# EAGLE design MAX31856_BREAKOUT_x4 (EAGLE 7.2.0)
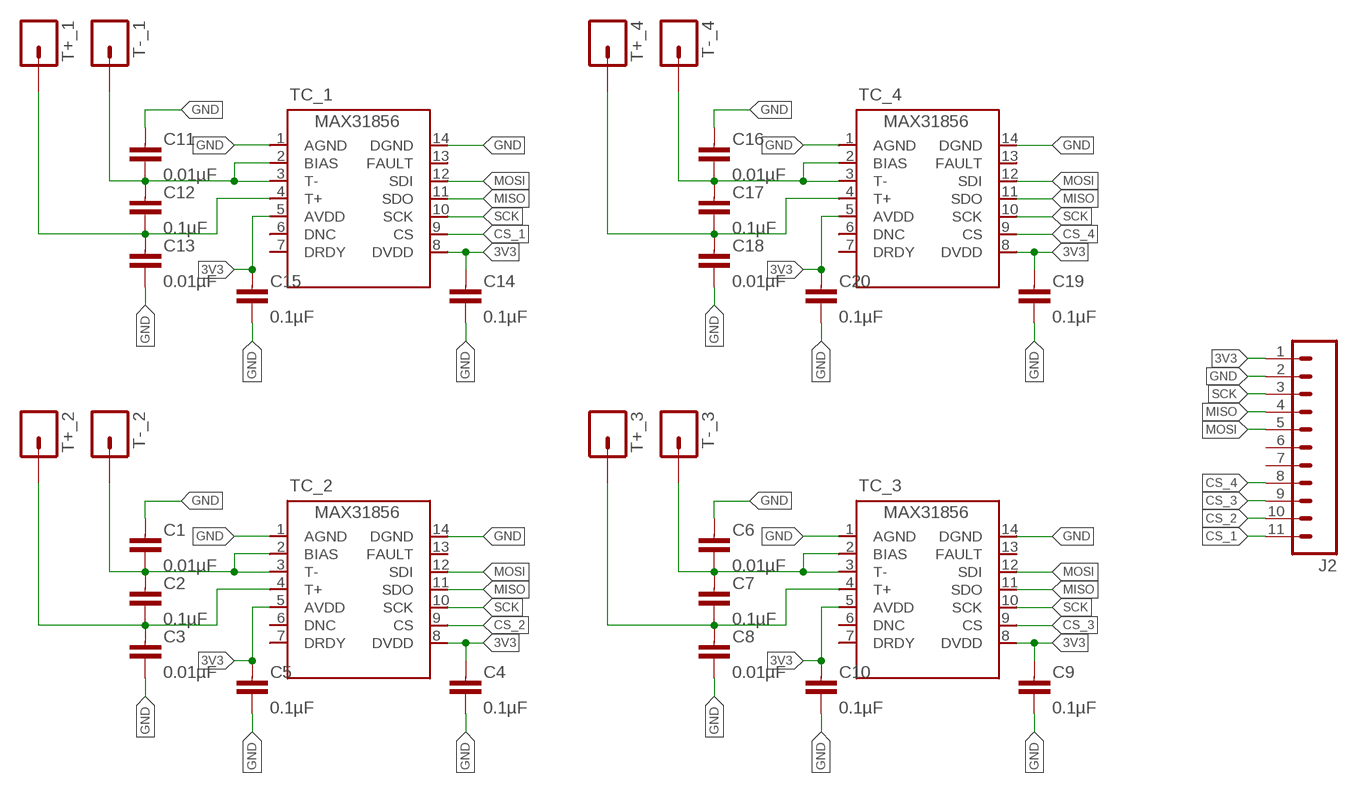
[diagram p0: schematic, sheet 1]

## Parts
C1  0.01µF  CAPACITOR0603-N  [C0603-N]
C2  0.1µF  CAPACITOR0603-N  [C0603-N]
C3  0.01µF  CAPACITOR0603-N  [C0603-N]
C4  0.1µF  CAPACITOR0603-N  [C0603-N]
C5  0.1µF  CAPACITOR0603-N  [C0603-N]
C6  0.01µF  CAPACITOR0603-N  [C0603-N]
C7  0.1µF  CAPACITOR0603-N  [C0603-N]
C8  0.01µF  CAPACITOR0603-N  [C0603-N]
C9  0.1µF  CAPACITOR0603-N  [C0603-N]
C10  0.1µF  CAPACITOR0603-N  [C0603-N]
C11  0.01µF  CAPACITOR0603-N  [C0603-N]
C12  0.1µF  CAPACITOR0603-N  [C0603-N]
C13  0.01µF  CAPACITOR0603-N  [C0603-N]
C14  0.1µF  CAPACITOR0603-N  [C0603-N]
C15  0.1µF  CAPACITOR0603-N  [C0603-N]
C16  0.01µF  CAPACITOR0603-N  [C0603-N]
C17  0.1µF  CAPACITOR0603-N  [C0603-N]
C18  0.01µF  CAPACITOR0603-N  [C0603-N]
C19  0.1µF  CAPACITOR0603-N  [C0603-N]
C20  0.1µF  CAPACITOR0603-N  [C0603-N]
J2  M11PTH  [1X11]
T+_1  M01SMD  [LUXEON-PAD]
T+_2  M01SMD  [LUXEON-PAD]
T+_3  M01SMD  [LUXEON-PAD]
T+_4  M01SMD  [LUXEON-PAD]
T-_1  M01SMD  [LUXEON-PAD]
T-_2  M01SMD  [LUXEON-PAD]
T-_3  M01SMD  [LUXEON-PAD]
T-_4  M01SMD  [LUXEON-PAD]
TC_1  MAX31856MUD+  [TSSOP14]
TC_2  MAX31856MUD+  [TSSOP14]
TC_3  MAX31856MUD+  [TSSOP14]
TC_4  MAX31856MUD+  [TSSOP14]

## Nets
3V3: C4.1 C5.1 C9.1 C10.1 C14.1 C15.1 C19.1 C20.1 J2.1 TC_1.5(AVDD) TC_1.8(DVDD) TC_2.5(AVDD) TC_2.8(DVDD) TC_3.5(AVDD) TC_3.8(DVDD) TC_4.5(AVDD) TC_4.8(DVDD)
CS_1: J2.11 TC_1.9(CS)
CS_2: J2.10 TC_2.9(CS)
CS_3: J2.9 TC_3.9(CS)
CS_4: J2.8 TC_4.9(CS)
GND: C1.1 C3.2 C4.2 C5.2 C6.1 C8.2 C9.2 C10.2 C11.1 C13.2 C14.2 C15.2 C16.1 C18.2 C19.2 C20.2 J2.2 TC_1.1(AGND) TC_1.14(DGND) TC_2.1(AGND) TC_2.14(DGND) TC_3.1(AGND) TC_3.14(DGND) TC_4.1(AGND) TC_4.14(DGND)
MISO: J2.4 TC_1.11(SDO) TC_2.11(SDO) TC_3.11(SDO) TC_4.11(SDO)
MOSI: J2.5 TC_1.12(SDI) TC_2.12(SDI) TC_3.12(SDI) TC_4.12(SDI)
N$1: C7.2 C8.1 T+_3.P$1 TC_3.4(T+)
N$2: C6.2 C7.1 T-_3.P$1 TC_3.2(BIAS) TC_3.3(T-)
N$3: C2.2 C3.1 T+_2.P$1 TC_2.4(T+)
N$4: C1.2 C2.1 T-_2.P$1 TC_2.2(BIAS) TC_2.3(T-)
N$5: C12.2 C13.1 T+_1.P$1 TC_1.4(T+)
N$6: C11.2 C12.1 T-_1.P$1 TC_1.2(BIAS) TC_1.3(T-)
N$7: C17.2 C18.1 T+_4.P$1 TC_4.4(T+)
N$8: C16.2 C17.1 T-_4.P$1 TC_4.2(BIAS) TC_4.3(T-)
SCK: J2.3 TC_1.10(SCK) TC_2.10(SCK) TC_3.10(SCK) TC_4.10(SCK)
Unconnected: J2.6 J2.7 TC_1.6(DNC) TC_1.7(DRDY) TC_1.13(FAULT) TC_2.6(DNC) TC_2.7(DRDY) TC_2.13(FAULT) TC_3.6(DNC) TC_3.7(DRDY) TC_3.13(FAULT) TC_4.6(DNC) TC_4.7(DRDY) TC_4.13(FAULT)

## Library data of the parts
C1-C20 = passives-7351:CAPACITOR
J2 = SparkFun-Connectors:M11: Header 11 Standard 11-pin 0.1" header. Use with straight break away headers (SKU : PRT-00116), right angle break away headers (PRT-00553), swiss pins (PRT-00743), machine pins (PRT-00117), and female headers (PRT-00115).
T+_1-T+_4 T-_1-T-_4 = SparkFun-Connectors:M01: Header 1 Standard 1-pin 0.1" header. Use with straight break away headers (SKU : PRT-00116), right angle break away headers (PRT-00553), swiss pins (PRT-00743), machine pins (PRT-00117), and female headers (PRT-00115). SMTSO-256-ET is a "flush mount" nut for a 4-40 screw. The older package used to be too tight, and did not allow it to sit properly thru the drill hit. The latest (0.165DIA) fits nice and snug.
TC_1-TC_4 = _my-parts:MAX31856MUD+

## Board
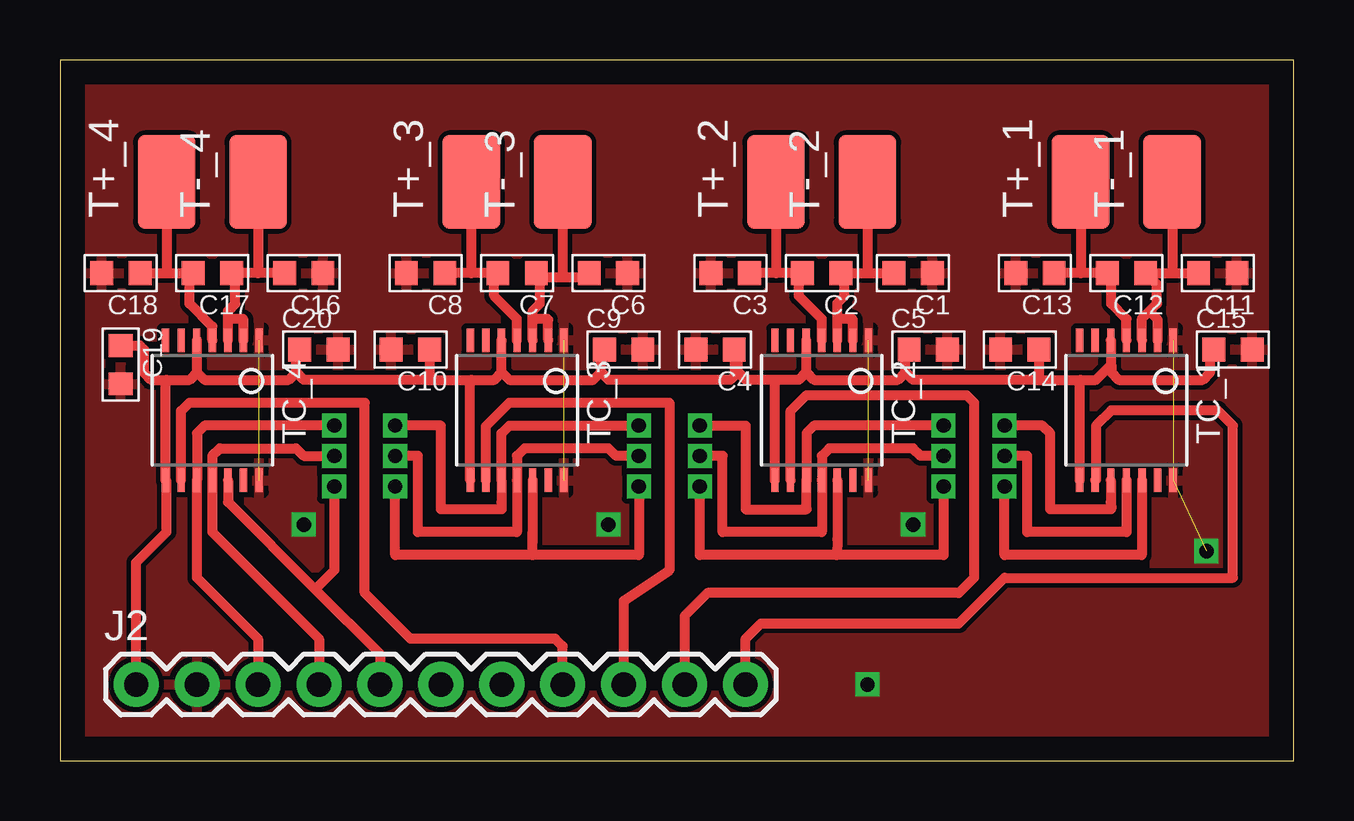
[diagram p1: board, top side]
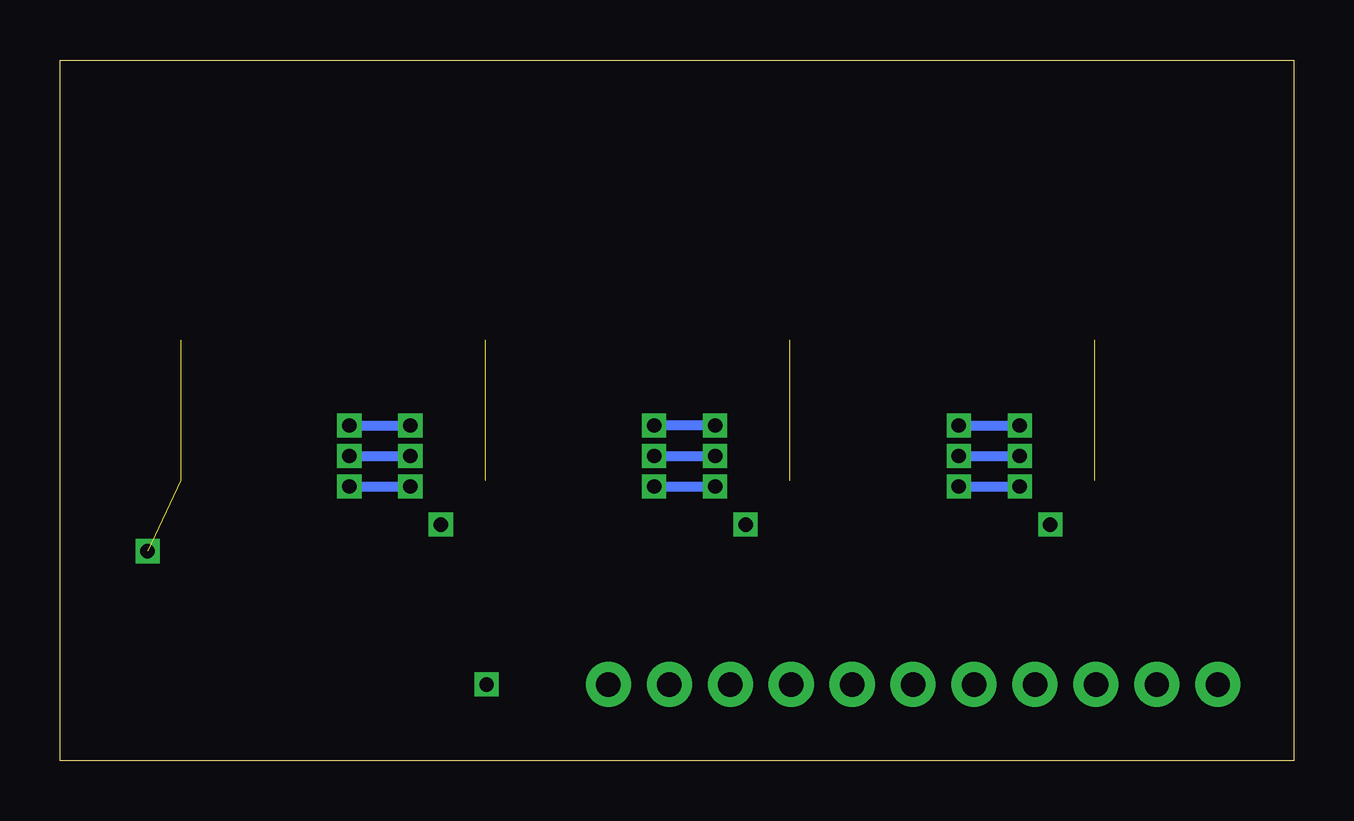
[diagram p2: board, bottom side, seen from below]

Size 51.44 x 29.21 mm. Coordinates in mm from the lower left corner, seen from the top.
Outline: 0,0 51.44,0 51.44,29.21 0,29.21 0,0
Copper layers (1*16): Top 0.035mm / dielectric 1.5mm / Bottom 0.035mm
Design rules "default": minimum track width 10mil, minimum drill 24mil, track to track 8mil, track to pad 8mil, pad to pad 8mil, via to via 8mil, smd to smd 8mil, copper to edge 40mil, drill to drill 8mil, minimum pad ring 10mil, minimum via ring 8mil, stop-mask expansion 4mil, vias tented up to drill 0mil, thermal gap 10mil

### Footprints (pad centres in the part's own frame; a part is rotated, then mirrored left to right if it is on the bottom)
C0603-N = smd 0.95 x 1: 1 -0.8,0; 2 0.8,0
1X11 = drill 1.016 pad 1.88: 1 0,0; 2 2.54,0; 3 5.08,0; 4 7.62,0; 5 10.16,0; 6 12.7,0; 7 15.24,0; 8 17.78,0; 9 20.32,0; 10 22.86,0; 11 25.4,0
LUXEON-PAD = smd 3.9 x 2.4: P$1 0,0
TSSOP14 = smd 0.305 x 0.991: 1 -1.95,-2.918; 2 -1.3,-2.918; 3 -0.65,-2.918; 4 0,-2.918; 5 0.65,-2.918; 6 1.3,-2.918; 7 1.95,-2.918; 8 1.95,2.918; 9 1.3,2.918; 10 0.65,2.918; 11 0,2.918; 12 -0.65,2.918; 13 -1.3,2.918; 14 -1.95,2.918

### Placement (x,y rotation side)
C1  35.56,20.32 180 top
C2  31.75,20.32 180 top
C3  27.94,20.32 180 top
C4  27.3,17.14 180 top
C5  36.2,17.14 0 top
C6  22.86,20.32 180 top
C7  19.05,20.32 180 top
C8  15.24,20.32 180 top
C9  23.5,17.14 0 top
C10  14.61,17.14 180 top
C11  48.26,20.32 180 top
C12  44.45,20.32 180 top
C13  40.64,20.32 180 top
C14  40.01,17.14 180 top
C15  48.9,17.14 0 top
C16  10.16,20.32 180 top
C17  6.35,20.32 180 top
C18  2.54,20.32 180 top
C19  2.54,16.51 270 top
C20  10.79,17.14 0 top
J2  3.17,3.17 0 top
T+_1  42.55,24.13 90 top
T+_2  29.84,24.13 90 top
T+_3  17.14,24.13 90 top
T+_4  4.45,24.13 90 top
T-_1  46.35,24.13 90 top
T-_2  33.66,24.13 90 top
T-_3  20.95,24.13 90 top
T-_4  8.26,24.13 90 top
TC_1  44.45,14.61 180 top
TC_2  31.75,14.61 180 top
TC_3  19.05,14.61 180 top
TC_4  6.35,14.61 180 top

### Tracks (layer width: path | path; a pad name or v marks a point on that pad's centre or on a via)
3V3
  Top 0.406: C19.1 3.33,17.31 3.49,17.14 3.49,16.19 3.81,15.88 4.45,15.88 | 4.45,15.88 5.4,15.88 5.71,16.19 5.71,17.51 TC_4.5 5.7,16.21 6.03,15.88 9.53,15.88 9.84,16.19 | 9.84,16.19 9.84,16.99 C20.1 | C10.1 15.4,16.04 15.24,15.88 | 15.24,15.88 10.16,15.88 9.84,16.19 | 15.24,15.88 17.14,15.88 | 17.14,15.88 18.1,15.88 18.41,16.19 | 18.41,16.19 18.41,17.51 TC_3.5 | 18.41,16.19 18.73,15.88 22.23,15.88 22.54,16.19 | 22.54,16.19 22.54,16.99 C9.1 | TC_2.5 31.1,16.18 | 31.1,16.18 30.8,15.88 29.84,15.88 | 29.84,15.88 28.57,15.88 28.26,16.19 28.26,16.99 C4.1 28.11,16.04 27.94,15.88 22.86,15.88 22.54,16.19 | 31.1,16.18 31.11,16.19 31.43,15.88 34.92,15.88 35.24,16.19 | 35.24,16.19 35.24,16.99 C5.1 | C14.1 40.8,16.04 40.64,15.88 | 40.64,15.88 35.56,15.88 35.24,16.19 | 40.64,15.88 42.55,15.88 | 42.55,15.88 43.18,15.88 43.81,16.51 | 43.81,16.51 43.81,17.51 TC_1.5 | 43.81,16.51 43.81,16.19 44.13,15.88 47.62,15.88 47.94,16.19 47.94,16.99 C15.1 | 4.45,15.88 4.4,15.83 TC_4.8 4.45,11.64 4.45,9.53 3.17,8.26 J2.1 | TC_3.8 17.1,15.83 17.14,15.88 | TC_2.8 29.8,15.83 29.84,15.88 | TC_1.8 42.5,15.83 42.55,15.88
CS_1
  Top 0.406: TC_1.9 43.18,11.72 43.18,13.97 43.81,14.61 48.26,14.61 48.9,13.97 48.9,7.62 39.37,7.62 37.47,5.71 29.21,5.71 28.57,5.08 J2.11
CS_2
  Top 0.406: TC_2.9 30.45,14.57 31.11,15.24 37.78,15.24 38.1,14.92 38.1,7.62 37.47,6.99 26.99,6.99 26.04,6.03 J2.10
CS_3
  Top 0.406: TC_3.9 17.75,13.94 18.73,14.92 25.4,14.92 25.4,7.94 23.5,6.67 J2.9
CS_4
  Top 0.406: TC_4.9 5.05,14.57 5.4,14.92 12.7,14.92 12.7,6.99 14.61,5.08 20.64,5.08 20.95,4.76 J2.8
GND  (via drill 0.6)  (5 unrouted)
  other vias: 10.16,9.84 22.86,9.84 35.56,9.84 33.66,3.17 47.78,8.73
  pour Top: 0,0 51.44,0 51.44,29.21 0,29.21
MISO  (via drill 0.6)
  Top 0.406: J2.4 10.79,5.08 6.35,9.53 TC_4.11 6.35,12.7 6.67,13.02 9.84,13.02 10.16,12.7 v11.43,12.7 | v13.97,12.7 14.92,12.7 14.92,9.53 19.05,9.53 TC_3.11 19.05,12.7 19.37,13.02 22.86,13.02 23.18,12.7 v24.13,12.7 | v26.67,12.7 27.62,12.7 27.62,9.53 31.75,9.53 TC_2.11 31.75,12.7 32.07,13.02 35.56,13.02 35.88,12.7 v36.83,12.7 | TC_1.11 44.45,9.53 40.32,9.53 40.32,12.7 v39.37,12.7
  Bottom 0.406: v13.97,12.7 v11.43,12.7 | v26.67,12.7 v24.13,12.7 | v39.37,12.7 v36.83,12.7
MOSI  (via drill 0.6)
  Top 0.406: TC_4.12 7,10.78 10.64,7.14 | 10.64,7.14 13.34,4.45 J2.5 | TC_3.12 19.7,9.54 | 19.7,9.54 19.7,8.57 24.13,8.57 v24.13,11.43 | 19.7,9.54 19.68,8.57 13.97,8.57 v13.97,11.43 | TC_2.12 32.4,9.22 32.38,8.57 | 32.38,8.57 26.67,8.57 v26.67,11.43 | TC_1.12 45.1,9.54 45.09,8.57 39.37,8.57 v39.37,11.43 | v36.83,11.43 36.83,8.57 32.38,8.57 | v11.43,11.43 11.43,7.94 10.64,7.14
  Bottom 0.406: v13.97,11.43 v11.43,11.43 | v26.67,11.43 v24.13,11.43 | v39.37,11.43 v36.83,11.43
N$1
  Top 0.406: TC_3.4 19.05,18.41 18.1,19.37 18.1,20.17 C7.2 17.14,20.32 | 17.14,20.32 C8.1 | T+_3.P$1 17.14,20.32
N$2
  Top 0.406: TC_3.3 19.7,18.41 | 19.7,18.41 19.7,18.75 20,19.05 20,20.17 | 20,20.17 C7.1 | TC_3.2 20.35,18.39 20.32,18.41 19.7,18.41 | 20,20.17 20.95,20.17 | 20.95,20.17 21.91,20.17 C6.2 | T-_3.P$1 20.95,20.17
N$3
  Top 0.406: TC_2.4 31.75,18.41 30.8,19.37 30.8,20.17 C2.2 29.84,20.32 | 29.84,20.32 C3.1 | T+_2.P$1 29.84,20.32
N$4
  Top 0.406: TC_2.3 32.4,18.41 | 32.4,18.41 32.4,19.07 32.7,19.37 32.7,20.17 C2.1 33.66,20.32 | 33.66,20.32 C1.2 | T-_2.P$1 33.66,20.32 | TC_2.2 33.05,18.39 33.02,18.41 32.4,18.41
N$5
  Top 0.406: TC_1.4 44.45,18.41 43.81,19.05 43.81,20.16 C12.2 42.55,20.32 | 42.55,20.32 C13.1 | T+_1.P$1 42.55,20.32
N$6
  Top 0.406: TC_1.3 45.1,18.43 45.4,18.73 | 45.4,18.73 45.72,19.05 45.72,19.85 C12.1 46.35,20.32 | 46.35,20.32 C11.2 | T-_1.P$1 46.35,20.32 | TC_1.2 45.75,18.39 45.4,18.73
N$7
  Top 0.406: TC_4.4 6.35,18.1 5.4,19.05 5.4,20.17 C17.2 4.45,20.32 | C18.1 4.45,20.32 | T+_4.P$1 4.45,20.32
N$8
  Top 0.406: TC_4.3 7,18.41 | 7,18.41 7,18.75 7.3,19.05 7.3,20.17 C17.1 8.26,20.32 | C16.2 8.26,20.32 | T-_4.P$1 8.26,20.32 | TC_4.2 7.65,18.39 7.62,18.41 7,18.41
SCK  (via drill 0.6)
  Top 0.406: J2.3 8.26,5.08 5.71,7.62 5.71,11.67 TC_4.10 5.71,11.7 5.71,13.65 6.03,13.97 v11.43,13.97 | v13.97,13.97 15.88,13.97 15.88,10.48 18.41,10.48 18.4,10.78 TC_3.10 18.4,13.64 18.73,13.97 v24.13,13.97 | v26.67,13.97 28.57,13.97 28.57,10.48 31.11,10.48 31.11,11.67 TC_2.10 31.11,11.7 31.11,13.65 31.43,13.97 v36.83,13.97 | TC_1.10 43.8,10.78 43.81,10.48 41.27,10.48 41.27,13.65 40.96,13.97 v39.37,13.97
  Bottom 0.406: v13.97,13.97 v11.43,13.97 | v24.13,13.97 v26.67,13.97 | v39.37,13.97 v36.83,13.97